# EAGLE design CameraBoard (EAGLE 9.6.1)

## Sheet 1 of 2: Power Management
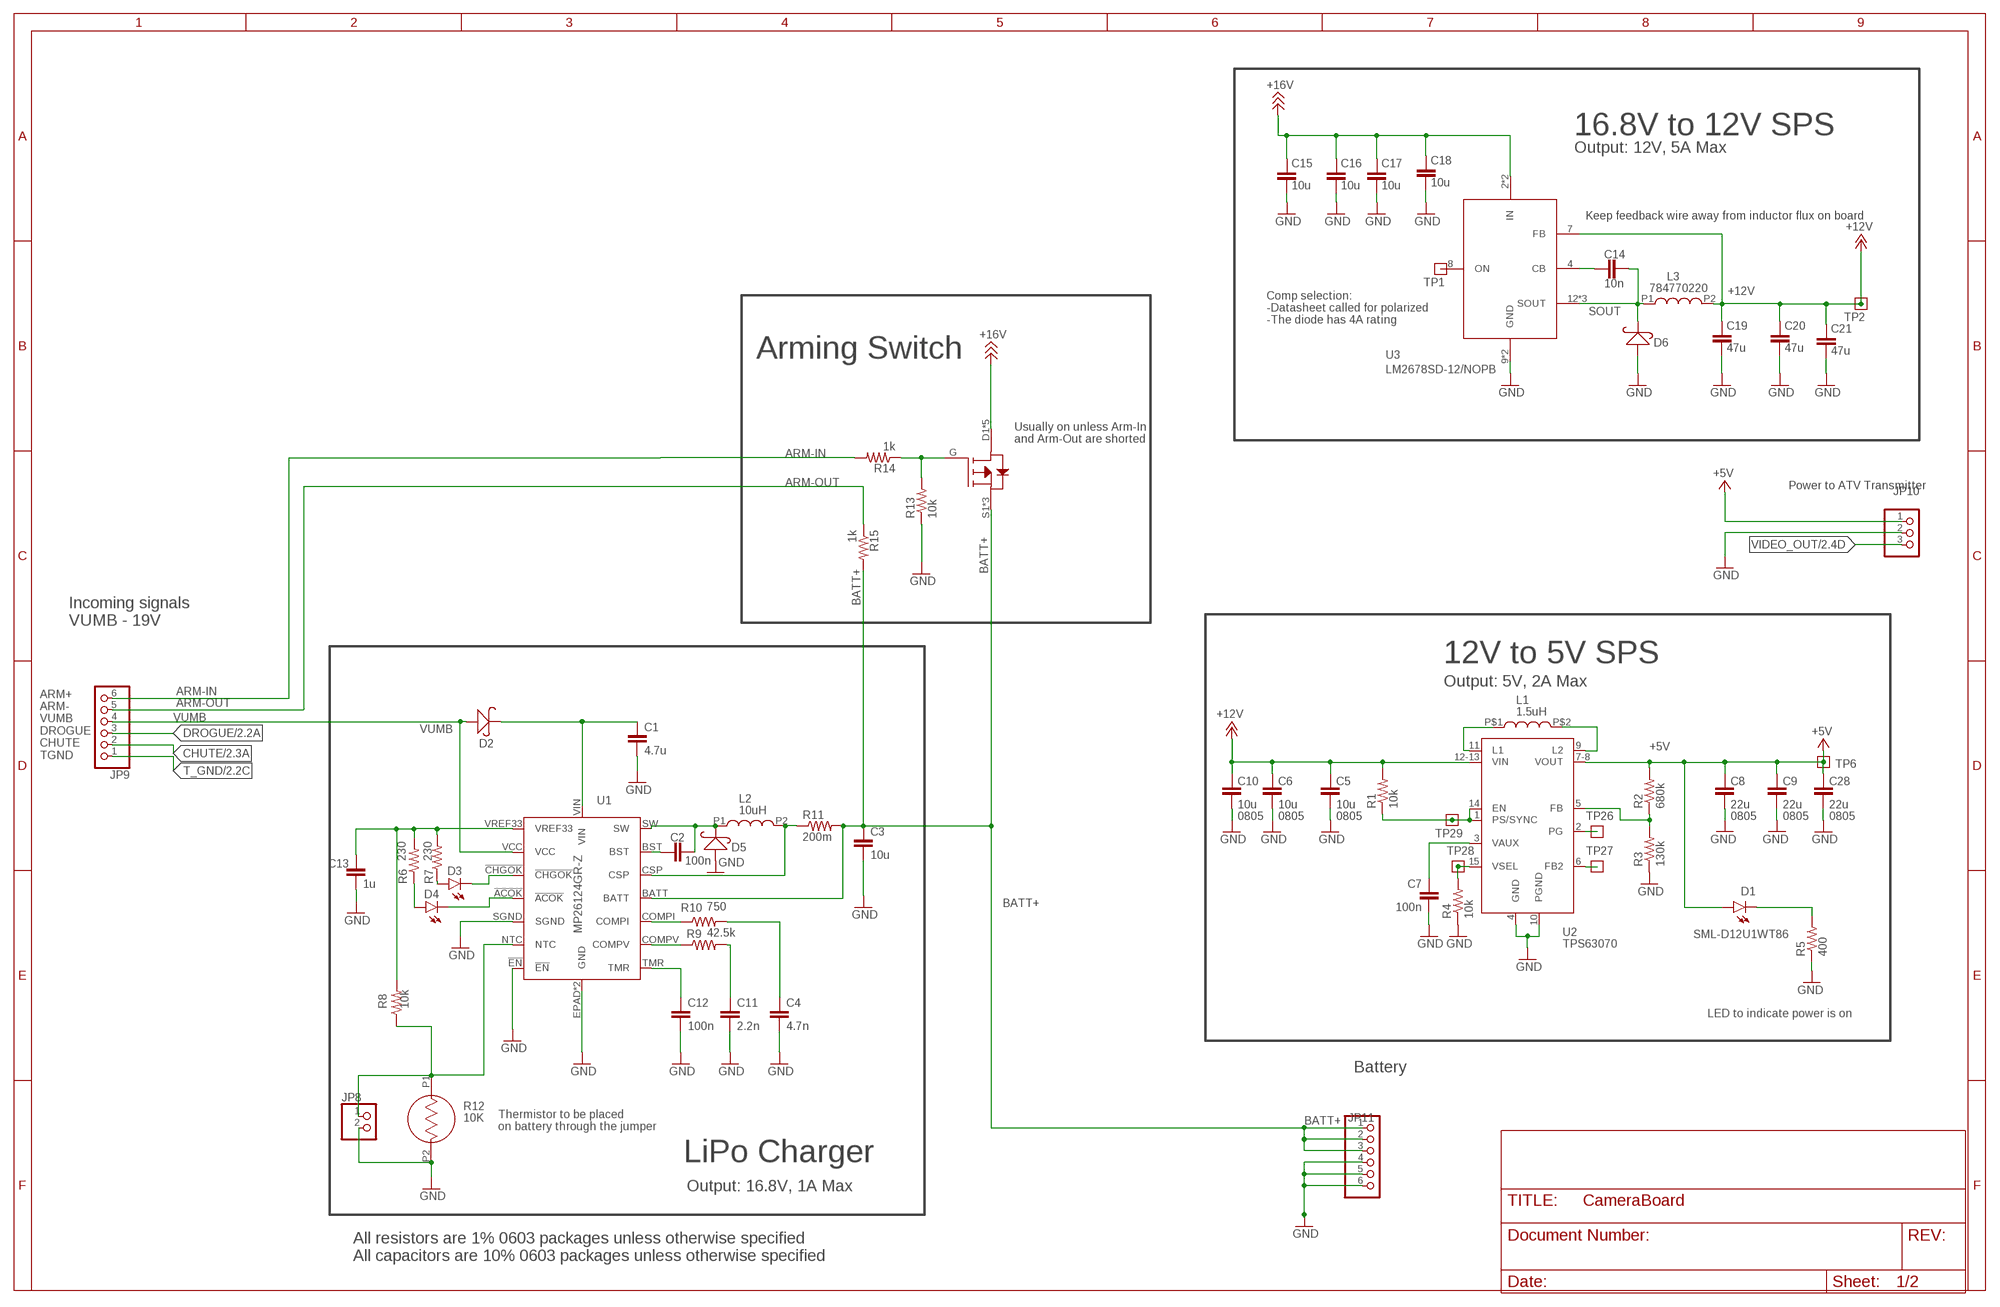
[diagram p0: schematic, sheet 1]

### Parts
C1  4.7u  C-EU0603-A-NOSILK  [.0603-A-NOSILK]
C2  100n  C-EU0603-A-NOSILK  [.0603-A-NOSILK]
C3  10u  C-EU0603-A-NOSILK  [.0603-A-NOSILK]
C4  4.7n  C-EU0603-A-NOSILK  [.0603-A-NOSILK]
C5  10u  C-EU0805-C-NOSILK  [.0805-C-NOSILK]
C6  10u  C-EU0805-C-NOSILK  [.0805-C-NOSILK]
C7  100n  C-EU0603-C-NOSILK  [.0603-C-NOSILK]
C8  22u  C-EU0805-C-NOSILK  [.0805-C-NOSILK]
C9  22u  C-EU0805-C-NOSILK  [.0805-C-NOSILK]
C10  10u  C-EU0805-C-NOSILK  [.0805-C-NOSILK]
C11  2.2n  C-EU0603-A-NOSILK  [.0603-A-NOSILK]
C12  100n  C-EU0603-A-NOSILK  [.0603-A-NOSILK]
C13  1u  C-EU0603-A-NOSILK  [.0603-A-NOSILK]
C14  10n  C-EU0603-A-NOSILK  [.0603-A-NOSILK]
C15  10u  C-EU0805-B-NOSILK  [.0805-B-NOSILK]
C16  10u  C-EU0805-B-NOSILK  [.0805-B-NOSILK]
C17  10u  C-EU0805-B-NOSILK  [.0805-B-NOSILK]
C18  10u  C-EU0805-B-NOSILK  [.0805-B-NOSILK]
C19  47u  C-EU1206-A  [1206-A]
C20  47u  C-EU1206-A  [1206-A]
C21  47u  C-EU1206-A  [1206-A]
C28  22u  C-EU0805-C-NOSILK  [.0805-C-NOSILK]
D1  SML-D12U1WT86  LEDCHIPLED_0603  [CHIPLED_0603]
D2  S2MA-13-F  [S2MA-13-F]
D3  SML-D12U1WT86  LEDCHIPLED_0603  [CHIPLED_0603]
D4  SML-D12U1WT86  LEDCHIPLED_0603  [CHIPLED_0603]
D5  S2MA-13-F  [S2MA-13-F]
D6  D_MBRS340T3G  [SMC]
JP8  PINHD-1X2  [1X02]
JP9  PINHD-1X6  [1X06]
JP10  PINHD-1X3  [1X03]
JP11  PINHD-1X6  [1X06]
L1  1.5uH  IHLP2020CZER1R5M11  [IHLP2020CZER1R5M11]
L2  10uH  1239AS-H-100M=P2  [1239AS-H-100M=P2]
L3  784770220  [784770220]
Q1  SI7465DP-T1-E3  [SI7465DP-T1-E3CT-ND]
R1  10k  R-US_0603-C-NOSILK  [.0603-C-NOSILK]
R2  680k  R-US_0603-C-NOSILK  [.0603-C-NOSILK]
R3  130k  R-US_0603-C-NOSILK  [.0603-C-NOSILK]
R4  10k  R-US_0603-C-NOSILK  [.0603-C-NOSILK]
R5  400  R-US_0603-C-NOSILK  [.0603-C-NOSILK]
R6  230  R-US_0603-A-NOSILK  [.0603-A-NOSILK]
R7  230  R-US_0603-A-NOSILK  [.0603-A-NOSILK]
R8  10k  R-US_0603-A-NOSILK  [.0603-A-NOSILK]
R9  42.5k  R-US_0603-A-NOSILK  [.0603-A-NOSILK]
R10  750  R-US_0603-A-NOSILK  [.0603-A-NOSILK]
R11  200m  R-US_1206-A  [1206-A]
R12  10K  NHQ103B375T10  [NHQ103B375T10]
R13  10k  R-US_0603-A-NOSILK  [.0603-A-NOSILK]
R14  1k  R-US_0603-A-NOSILK  [.0603-A-NOSILK]
R15  1k  R-US_0603-A-NOSILK  [.0603-A-NOSILK]
TP1  TEST-POINT  [2MM-TEST-POINT]
TP2  TEST-POINT  [2MM-TEST-POINT]
TP6  TEST-POINT  [2MM-TEST-POINT]
TP26  TEST-POINT  [2MM-TEST-POINT]
TP27  TEST-POINT  [2MM-TEST-POINT]
TP28  TEST-POINT  [2MM-TEST-POINT]
TP29  TEST-POINT  [2MM-TEST-POINT]
U1  MP26124GR-Z  [MP26124GR-Z]
U2  TPS63070  TPS63070X  [TPS63070X]
U3  LM2678SD-12/NOPB  [LM2678SD-12/NOPB]

### Nets
+5V: C8.1 C9.1 C28.1 D1.A JP10.1 R2.2 TP6.1 U2.7-8(VOUT) ; also sheet 2
+12V: C5.1 C6.1 C10.1 C19.1 C20.1 C21.1 L3.P2 R1.2 TP2.1 U2.12-13(VIN) U3.7(FB) ; also sheet 2
+16V: C15.1 C16.1 C17.1 C18.1 Q1.D1(D) Q1.D2(D) Q1.D3(D) Q1.D4(D) Q1.DPAD(D) U3.2(IN) U3.3(IN)
ARM-IN: JP9.6 R14.2
ARM-OUT: JP9.5 R15.1
BATT+: C3.1 JP11.1 JP11.2 JP11.3 Q1.S1(S) Q1.S2(S) Q1.S3(S) R11.2 R15.2 U1.BATT
CHUTE: JP9.2 ; also sheet 2
DROGUE: JP9.3 ; also sheet 2
GND: C1.2 C3.2 C4.2 C5.2 C6.2 C7.2 C8.2 C9.2 C10.2 C11.2 C12.2 C13.2 C15.2 C16.2 C17.2 C18.2 C19.2 C20.2 C21.2 C28.2 D5.ANODE(+) D6.2(+) JP8.2 JP10.2 JP11.4 JP11.5 JP11.6 R3.1 R4.1 R5.1 R12.P2 R13.1 U1.!EN U1.EPAD(GND) U1.GND U1.SGND U2.4(GND) U2.10(PGND) U3.9(GND) U3.DAP(GND) ; also sheet 2
N$1: D1.C R5.2
N$2: C1.1 D2.CATHODE(-) U1.VIN
N$3: Q1.G R13.2 R14.1
N$4: C13.1 R6.2 R7.2 R8.2 U1.VREF33
N$5: D4.A R6.1
N$6: D3.A R7.1
N$7: D3.C U1.!CHGOK
N$8: D4.C U1.!ACOK
N$9: C12.1 U1.TMR
N$10: JP8.1 R8.1 R12.P1 U1.NTC
N$11: R9.1 U1.COMPV
N$12: C11.1 R9.2
N$13: R10.1 U1.COMPI
N$14: C4.1 R10.2
N$15: C2.1 D5.CATHODE(-) L2.P1 U1.SW
N$16: C2.2 U1.BST
N$17: L2.P2 R11.1 U1.CSP
N$18: TP1.1 U3.8(ON)
N$20: C14.2 U3.4(CB)
SOUT: C14.1 D6.1(-) L3.P1 U3.12(SOUT) U3.13(SOUT) U3.14(SOUT)
T_GND: JP9.1 ; also sheet 2
TPS-EN: R1.1 TP29.1 U2.1(PS/SYNC) U2.14(EN)
TPS-FB: R2.1 R3.2 U2.5(FB)
TPS-FB2: TP27.1 U2.6(FB2)
TPS-L1: L1.P$1 U2.11(L1)
TPS-L2: L1.P$2 U2.9(L2)
TPS-PG: TP26.1 U2.2(PG)
TPS-VAUX: C7.1 U2.3(VAUX)
TPS-VSEL: R4.2 TP28.1 U2.15(VSEL)
VIDEO_OUT: JP10.3 ; also sheet 2
VUMB: D2.ANODE(+) JP9.4 U1.VCC

### Notes on the sheet
- 16.8V to 12V SPS
- Output: 12V, 5A Max
- Keep feedback wire away from inductor flux on board
- Comp selection:
  -Datasheet called for polarized
  -The diode has 4A rating
- Arming Switch
- Usually on unless Arm-In
  and Arm-Out are shorted
- Power to ATV Transmitter
- Incoming signals
  VUMB - 19V
- 12V to 5V SPS
- Output: 5V, 2A Max
- ARM+
  ARM-
  VUMB
  DROGUE
  CHUTE
  TGND
- 0805 | 0805 | 0805 | 0805 | 0805 | 0805
- LED to indicate power is on
- Battery
- Thermistor to be placed 
  on battery through the jumper
- LiPo Charger
- Output: 16.8V, 1A Max
- All resistors are 1% 0603 packages unless otherwise specified
  All capacitors are 10% 0603 packages unless otherwise specified

## Sheet 2 of 2: Camera Control
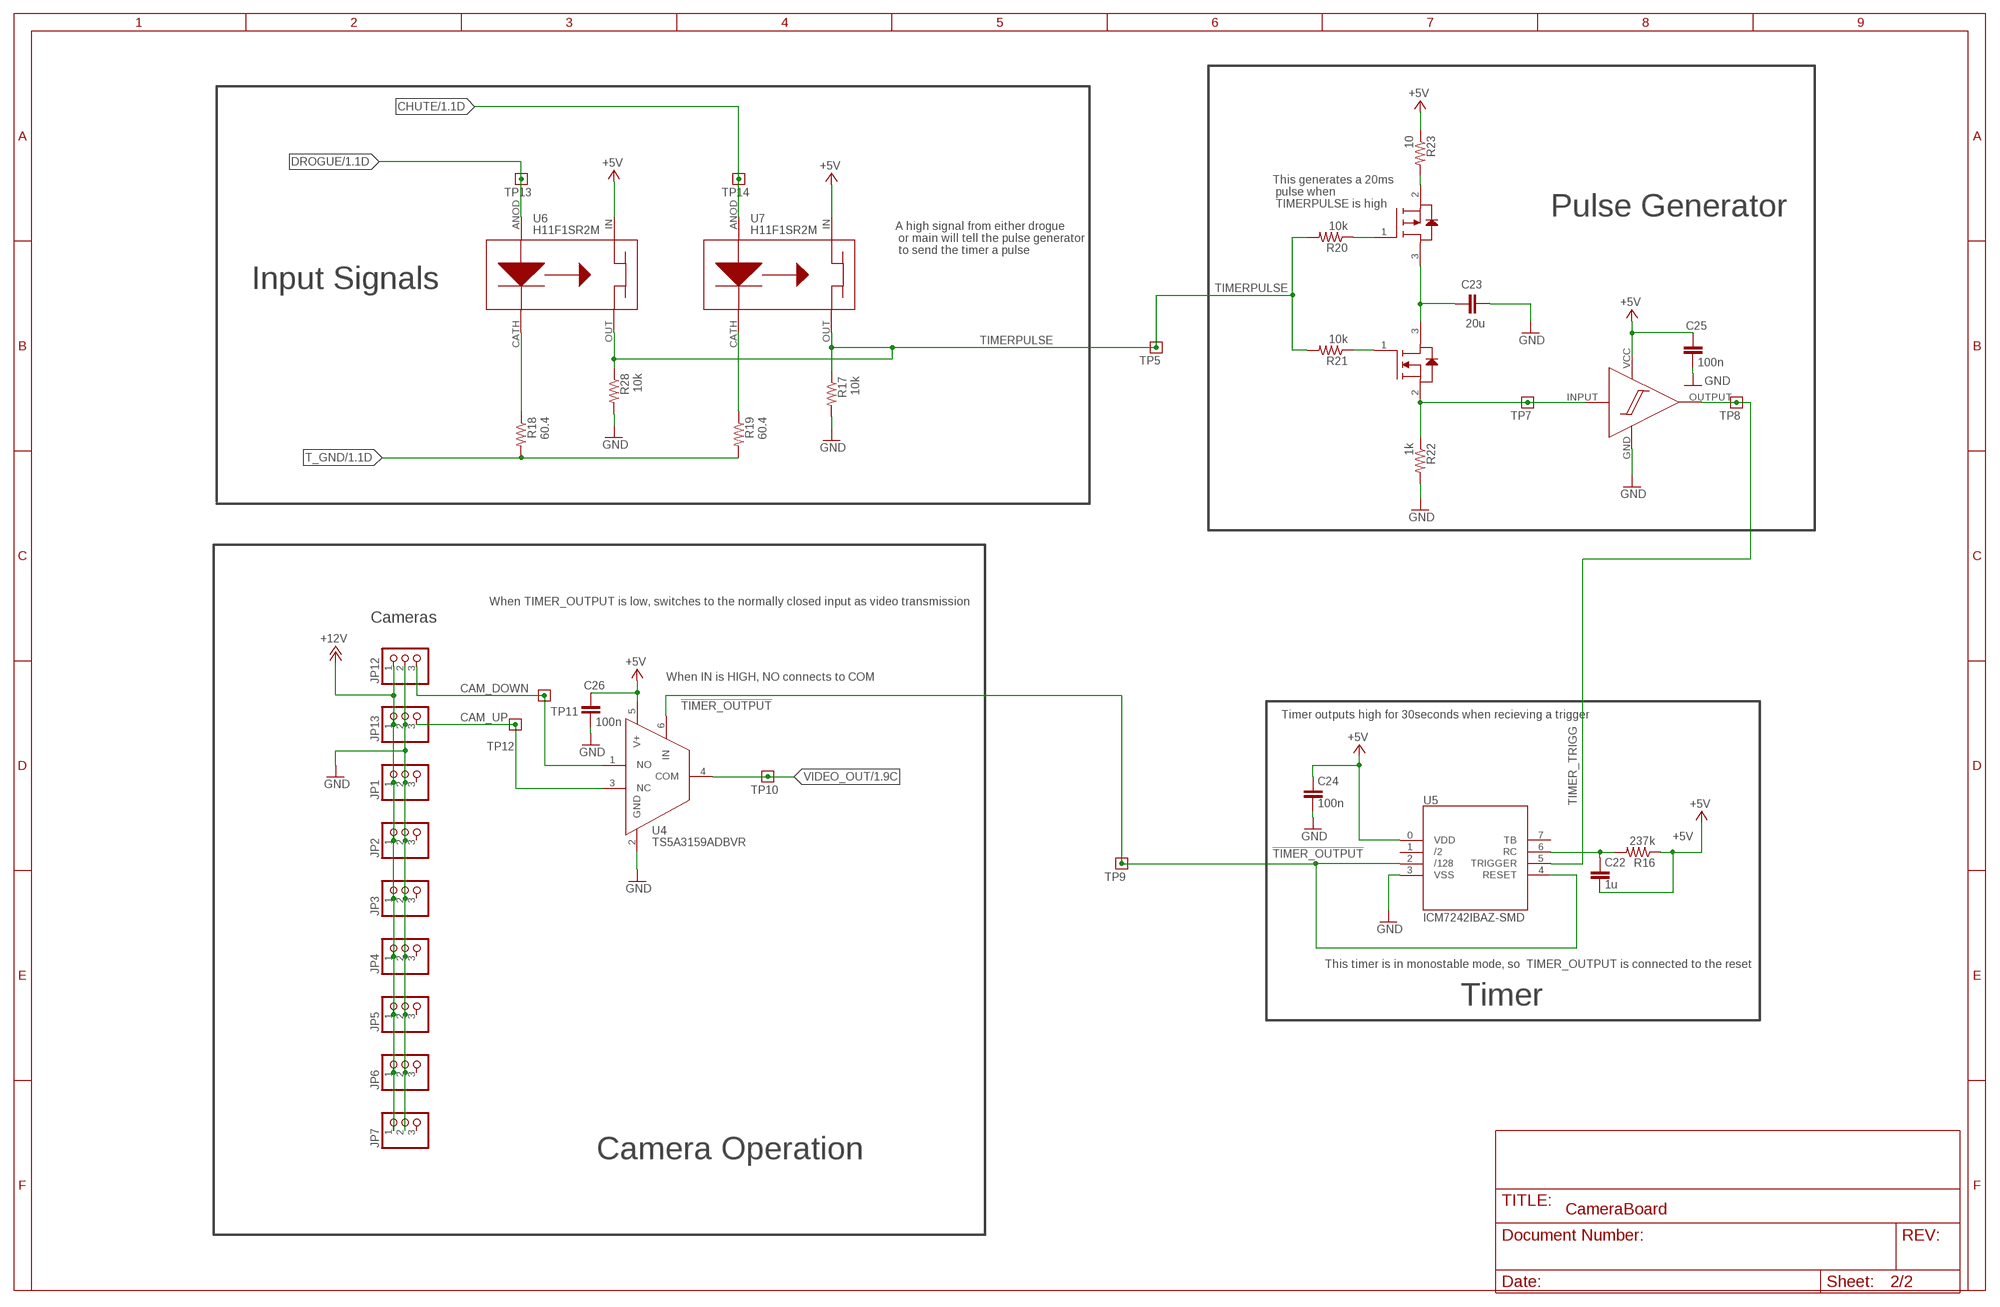
[diagram p1: schematic, sheet 2]

### Parts
C22  1u  C-EU0603-C-NOSILK  [.0603-C-NOSILK]
C23  20u  C-EU0603-C-NOSILK  [.0603-C-NOSILK]
C24  100n  C-EU0603-C-NOSILK  [.0603-C-NOSILK]
C25  100n  C-EU0603-C-NOSILK  [.0603-C-NOSILK]
C26  100n  C-EU0603-C-NOSILK  [.0603-C-NOSILK]
JP1  PINHD-1X3  [1X03]
JP2  PINHD-1X3  [1X03]
JP3  PINHD-1X3  [1X03]
JP4  PINHD-1X3  [1X03]
JP5  PINHD-1X3  [1X03]
JP6  PINHD-1X3  [1X03]
JP7  PINHD-1X3  [1X03]
JP12  PINHD-1X3  [1X03]
JP13  PINHD-1X3  [1X03]
Q2  BVSS123LT1G  [BVSS123LT1G]
Q3  BSS84  [BSS84]
R16  237k  R-US_0603-A-NOSILK  [.0603-A-NOSILK]
R17  10k  R-US_0603-C-NOSILK  [.0603-C-NOSILK]
R18  60.4  R-US_0603-C-NOSILK  [.0603-C-NOSILK]
R19  60.4  R-US_0603-C-NOSILK  [.0603-C-NOSILK]
R20  10k  R-US_0603-A-NOSILK  [.0603-A-NOSILK]
R21  10k  R-US_0603-A-NOSILK  [.0603-A-NOSILK]
R22  1k  R-US_0603-A-NOSILK  [.0603-A-NOSILK]
R23  10  R-US_0805-A-NOSILK  [.0805-A-NOSILK]
R28  10k  R-US_0603-C-NOSILK  [.0603-C-NOSILK]
TP5  TEST-POINT  [2MM-TEST-POINT]
TP7  TEST-POINT  [2MM-TEST-POINT]
TP8  TEST-POINT  [2MM-TEST-POINT]
TP9  TEST-POINT  [2MM-TEST-POINT]
TP10  TEST-POINT  [2MM-TEST-POINT]
TP11  TEST-POINT  [2MM-TEST-POINT]
TP12  TEST-POINT  [2MM-TEST-POINT]
TP13  TEST-POINT  [2MM-TEST-POINT]
TP14  TEST-POINT  [2MM-TEST-POINT]
U4  TS5A3159ADBVR  [TS5A3159ADBVR]
U5  ICM7242IBAZ-SMD  [ICM7242IBAZ-SMD]
U6  H11F1SR2M  [H11F1SR2M]
U7  H11F1SR2M  [H11F1SR2M]
U8  SN74LVC1G17DCKR  [SN74LVC1G17DCKR]

### Nets
!TIMER_OUTPUT: TP9.1 U4.6(IN) U5.2(/128) U5.4(RESET)
+5V: C22.2 C24.1 C25.2 C26.2 R16.1 R23.1 U4.5(V+) U5.0(VDD) U6.IN U7.IN U8.VCC ; also sheet 1
+12V: JP1.1 JP2.1 JP3.1 JP4.1 JP5.1 JP6.1 JP7.1 JP12.1 JP13.1 ; also sheet 1
CAM_DOWN: JP12.3 TP11.1 U4.1(NO)
CAM_UP: JP13.3 TP12.1 U4.3(NC)
CHUTE: TP14.1 U7.ANOD ; also sheet 1
DROGUE: TP13.1 U6.ANOD ; also sheet 1
GND: C23.2 C24.2 C25.1 C26.1 JP1.2 JP2.2 JP3.2 JP4.2 JP5.2 JP6.2 JP7.2 JP12.2 JP13.2 R17.2 R22.2 R28.2 U4.2(GND) U5.3(VSS) U8.GND ; also sheet 1
N$22: R18.1 U6.CATH(CAT)
N$23: R19.1 U7.CATH(CAT)
N$24: C22.1 R16.2 U5.6(RC)
N$25: C23.1 Q2.3(D) Q3.3(D)
N$26: Q3.2(S) R23.2
N$28: Q3.1(G) R20.1
N$29: Q2.1(G) R21.1
SCHMITTIN: Q2.2(S) R22.1 TP7.1 U8.INPUT(A)
T_GND: R18.2 R19.2 ; also sheet 1
TIMER_TRIGG: TP8.1 U5.5(TRIGGER) U8.OUTPUT(Y)
TIMERPULSE: R17.1 R20.2 R21.2 R28.1 TP5.1 U6.OUT U7.OUT
VIDEO_OUT: TP10.1 U4.4(COM) ; also sheet 1
Unconnected: JP1.3 JP2.3 JP3.3 JP4.3 JP5.3 JP6.3 JP7.3 U5.1(/2) U5.7(TB)

### Notes on the sheet
- This generates a 20ms
   pulse when
   TIMERPULSE is high
- Pulse Generator
- A high signal from either drogue
   or main will tell the pulse generator
   to send the timer a pulse
- Input Signals
- When TIMER_OUTPUT is low, switches to the normally closed input as video transmission
- Cameras
- When IN is HIGH, NO connects to COM
- Timer outputs high for 30seconds when recieving a trigger
- This timer is in monostable mode, so  TIMER_OUTPUT is connected to the reset
- Timer
- Camera Operation

## Library data of the parts
C1-C4 C6 C9-C26 C28 = oresat-rcl:C-EU: CAPACITOR, European symbol
C5 C7 C8 = oresat-rcl:C-EU: CAPACITOR, European symbol; DIS: Digi-Key; DPN: 1276-1001-1-ND; MFR: Samsung; MPN: CL05B104KO5NNNC
D1 D3 D4 = led:LED: LED OSRAM: - CHIPLED LG R971, LG N971, LY N971, LG Q971, LY Q971, LO R971, LY R971 LH N974, LH R974 LS Q976, LO Q976, LY Q976 LO Q996 - Hyper CHIPLED LW Q18S LB Q993, LB Q99A, LB R99A - SideLED LS A670, LO A670, LY A670, LG A670, LP A670 LB A673, LV A673, LT A673, LW A673 LH A674 LY A675 LS A676, LA A676, LO A676, LY A676, LW A676 LS A679, LY A679, LG A679 - Hyper Micro SIDELED® LS Y876, LA Y876, LO Y876, LY Y876 LT Y87S - SmartLED LW L88C, LW L88S LB L89C, LB L89S, LG L890 LS L89K, LO L89K, LY L89K LS L896, LA L896, LO L896, LY L896 - TOPLED LS T670, LO T670, LY T670, LG T670, LP T670 LSG T670, LSP T670, LSY T670, LOP T670, LYG T670 LG T671, LOG T671, LSG T671 LB T673, LV T673, LT T673, LW T673 LH T674 LS T676, LA T676, LO T676, LY T676, LB T676, LH T676, LSB T676, LW T676 LB T67C, LV T67C, LT T67C, LS T67K, LO T67K, LY T67K, LW E67C LS E67B, LA E67B, LO E67B, LY E67B, LB E67C, LV E67C, LT E67C LW T67C LS T679, LY T679, LG T679 LS T770, LO T770, LY T770, LG T770, LP T770 LB T773, LV T773, LT T773, LW T773 LH T774 LS E675, LA E675, LY E675, LS T675 LS T776, LA T776, LO T776, LY T776, LB T776 LHGB T686 LT T68C, LB T68C - Hyper Mini TOPLED® LB M676 - Mini TOPLED Santana® LG M470 LS M47K, LO M47K, LY M47K Source: http://www.osram.convergy.de LUXEON: - LUMILED® LXK2-PW12-R00, LXK2-PW12-S00, LXK2-PW14-U00, LXK2-PW14-V00 LXK2-PM12-R00, LXK2-PM12-S00, LXK2-PM14-U00 LXK2-PE12-Q00, LXK2-PE12-R00, LXK2-PE12-S00, LXK2-PE14-T00, LXK2-PE14-U00 LXK2-PB12-K00, LXK2-PB12-L00, LXK2-PB12-M00, LXK2-PB14-N00, LXK2-PB14-P00, LXK2-PB14-Q00 LXK2-PR12-L00, LXK2-PR12-M00, LXK2-PR14-Q00, LXK2-PR14-R00 LXK2-PD12-Q00, LXK2-PD12-R00, LXK2-PD12-S00 LXK2-PH12-R00, LXK2-PH12-S00 LXK2-PL12-P00, LXK2-PL12-Q00, LXK2-PL12-R00 Source: www.luxeon.com KINGBRIGHT: KA-3528ASYC Source: www.kingbright.com; DIS: Digikey; DPN: SML-D12M1WT86CT-ND; MAN: Rohm Semiconductor; MPN: SML-D12M1WT86
D2 D5 = D--S2MA-FDICT-ND--Schottky Diode 1.5A:S2MA-13-F
D6 = D--MBRS340T3G--Schottky Diode:D_MBRS340T3G; BUILT_BY: EMA_UL_Team; DIS: Digi-Key; DPN: MBRS340T3GOSTR-ND; MANUFACTURER_PART_NUMBER: MBRS340T3G; VENDOR: ON Semiconductor
JP1-JP7 JP10 JP12 JP13 = pinhead:PINHD-1X3: PIN HEADER
JP8 = pinhead:PINHD-1X2: PIN HEADER
JP9 JP11 = pinhead:PINHD-1X6: PIN HEADER
L1 = L--IHLP2020CZER1R5M11--1.5uHInductor:IHLP2020CZER1R5M11; DIS: Digi-Key; DPN: 541-1222-1-ND; MFR: Vishay Dale; MPN: IHLP2020BZER4R7M11
L2 = L--1239AS-H-100M=P2--10uH Inductor:1239AS-H-100M=P2; DIS: Digi-Key; DPN: 490-10563-2-ND; MAN: Murata Electronics; MPN: 1239AS-H-100M=P2
L3 = L--784770220--22uH 4A Inductor:784770220; DIS: Digi-Key; DPN: 732-6785-1-ND; MAN: Würth Elektronik; MPN: 784770220
Q1 = Q--Si7465DP--Vishay Power MOSFET with multple S+D leads:SI7465DP-T1-E3; DIS: DigiKey; DPN: SI7465DP-T1-E3CT-ND; MFR: Vishay Siliconix; MPN: SI7465DP-T1-E3
Q2 = Q--BVSS123LT1G--NCH MOSFET:BVSS123LT1G; DIS: Digi-Key; DPN: BVSS123LT1GOSCT-ND; MAN: On Semiconductor; MPN: BVSS123LT1G
Q3 = Q--BSS84CT-ND--PCH MOSFET:BSS84; DIS: Digi-Key; DPN: BSS84CT-ND; MAN: On Semiconductor; MPN: BSS84
R1-R5 = oresat-rcl:R-US_: RESISTOR, American symbol; DIS: Digi-Key; DPN: 1276-4275-1-ND; MFR: Samsung; MPN: RC1005F6653CS
R6-R11 R13-R23 R28 = oresat-rcl:R-US_: RESISTOR, American symbol
R12 = R--NHQ103B375T10--Thermistor 10K:NHQ103B375T10; DIS: Digi-Key; DPN: 235-1109-1-ND; MAN: Amphenol Advanced Sensors; MPN: NHQ103B375T10
TP1 TP2 TP5-TP14 TP26-TP29 = Tova:TEST-POINT
U1 = U--MP26124GR-Z--4S LiPo Charger :MP26124GR-Z; DIS: Digi-Key; DPN: 1589-1993-1-ND; MAN: Monolithic Power Systems Inc.; MPN: MP26124GR-Z
U2 = ic-pwr-tps63070x:TPS63070X: TPS63070 2-V to 16-V Buck-Boost Converter With 3.6-A Switch Current; DIS: Digi-Key; DPN: 296-44874-2-ND; MAN: Texas Instruments; MPN: TPS63070RNMR
U3 = U--LM2678SX-12-NOPB--TI 12V SPS:LM2678SD-12/NOPB; DIS: Digi-Key; DPN: 296-40166-1-ND; MAN: Texas Instruments; MPN: LM2678SD-12/NOPB
U4 = U--TS5A3159ADBVR--Analog Switch 5V and 3V3:TS5A3159ADBVR
U5 = U--ICM7242--Counter-Timer Circuit:ICM7242IBAZ-SMD; DIS: Digi-Key; DPN: 2156-ICM7242IBAZ-IL-ND; MAN: Rochester Electronics LLC; MPN: ICM7242IBAZ
U6 U7 = Q--H11F1SR2M--OptoIsolator:H11F1SR2M; DIS: Digi-Key; DPN: H11F1SR2MCT-ND; MAN: ON Semiconductor; MPN: H11F1SR2M
U8 = U--SN74LVC1G17--Schmitt Trigger Buffer:SN74LVC1G17DCKR; DIS: Digi-Key; DPN: 296-11934-1-ND; MAN: Texas Instruments; MPN: SN74LVC1G17DCKR

## Board
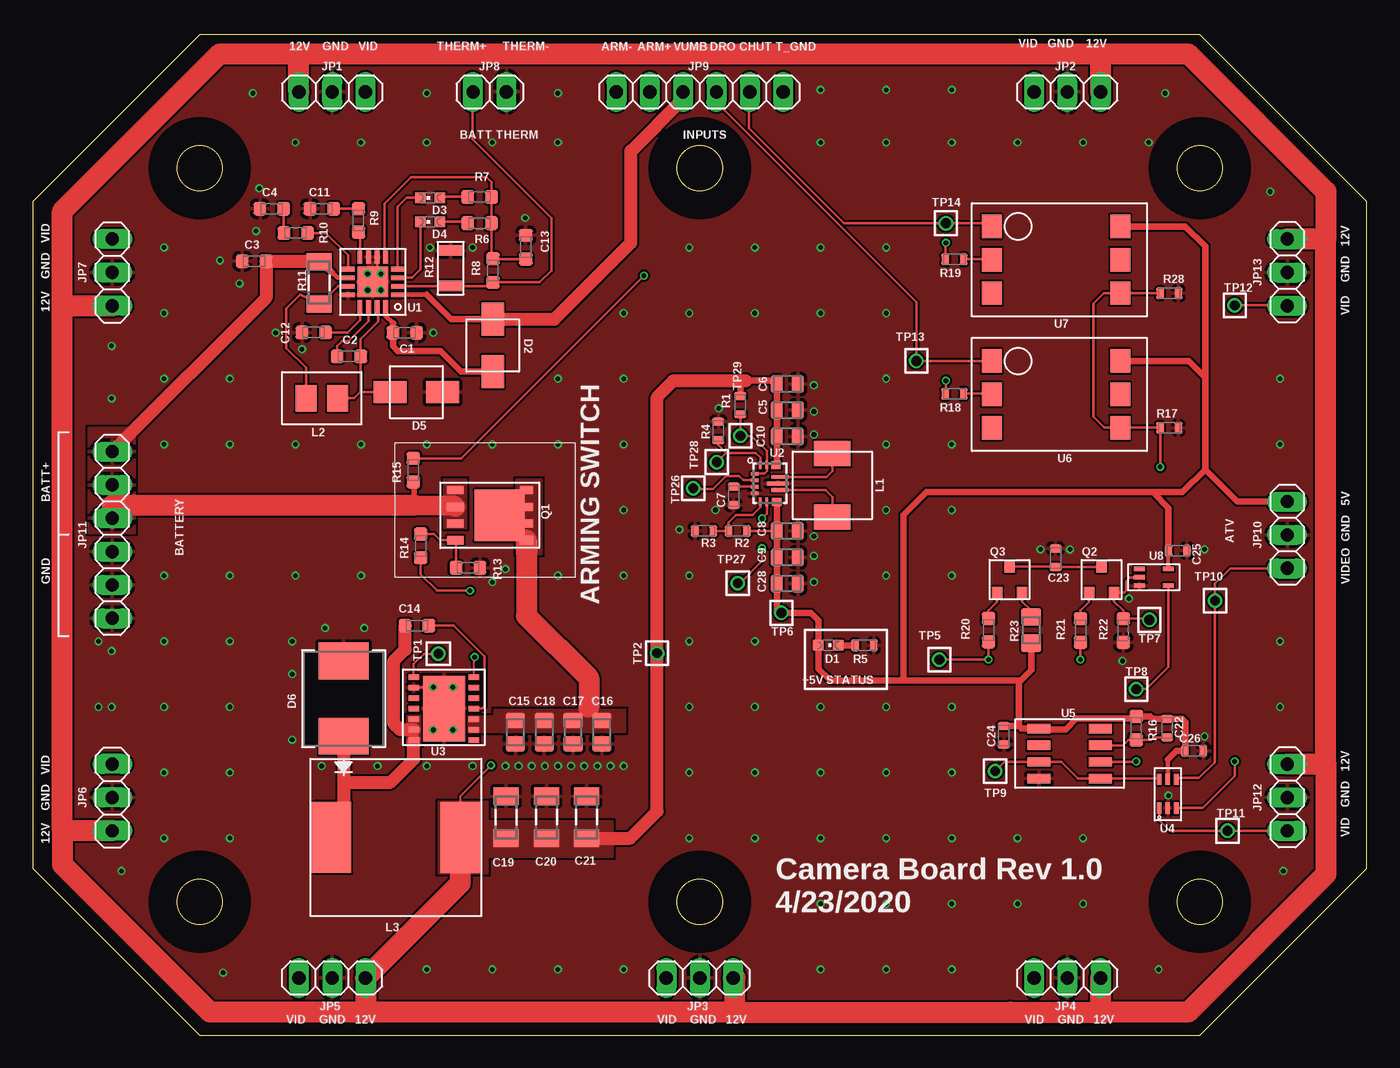
[diagram p2: board, top side]
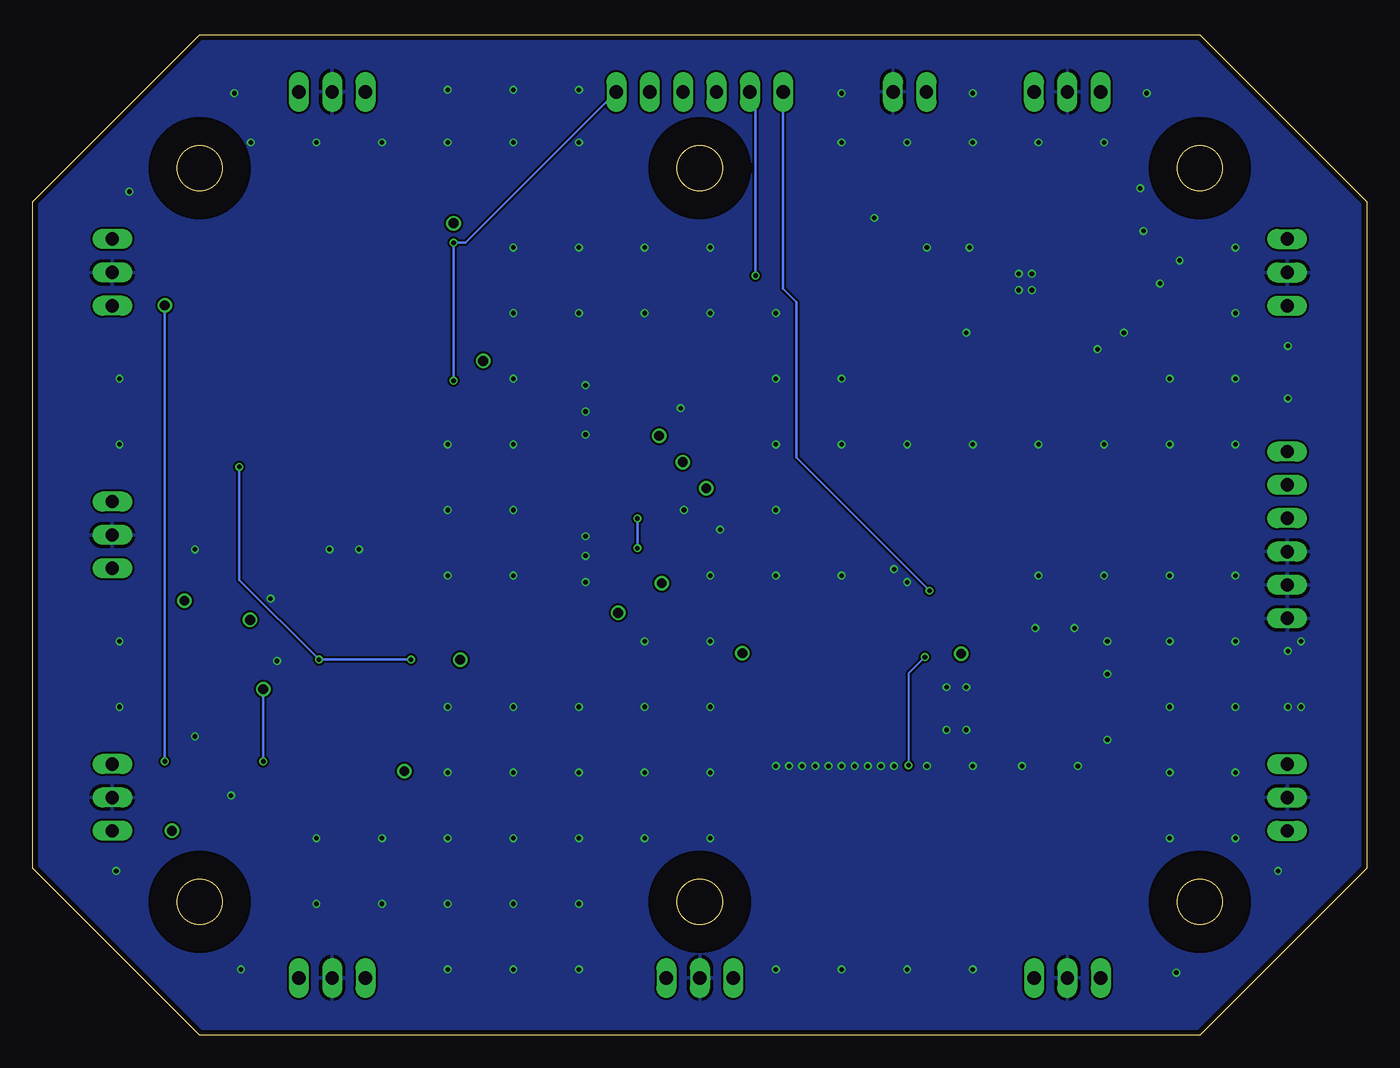
[diagram p3: board, bottom side, seen from below]

Size 101.6 x 76.2 mm. Coordinates in mm from the lower left corner, seen from the top.
Outline: 0,12.7 12.7,0 88.9,0 101.6,12.7 101.6,63.5 88.9,76.2 12.7,76.2 0,63.5 0,12.7
Outline: circle at 12.7,66.04 radius 1.73
Outline: circle at 50.8,66.04 radius 1.73
Outline: circle at 88.9,10.16 radius 1.73
Outline: circle at 12.7,10.16 radius 1.73
Outline: circle at 50.8,10.16 radius 1.73
Outline: circle at 88.9,66.04 radius 1.73
Copper layers (1*16): Top 0.035559375mm / dielectric 1.6mm / Bottom 0.035559375mm
Design rules "oshpark-4layer *": minimum track width 6mil, minimum drill 10mil, track to track 6mil, track to pad 6mil, pad to pad 6mil, via to via 6mil, smd to smd 6mil, copper to edge 15mil, drill to drill 6mil, minimum pad ring 5mil, minimum via ring 5mil, stop-mask expansion 2.5mil, vias tented up to drill 0.35mm, thermal gap 10mil
tKeepout: area 8.8,6.3 to 16.6,14; area 8.8,62.2 to 16.6,69.9; area 46.9,62.2 to 54.7,69.9; area 85,62.2 to 92.8,69.9; area 85,6.3 to 92.8,14; area 46.9,6.3 to 54.7,14
bKeepout: area 8.8,62.2 to 16.6,69.9; area 46.9,62.2 to 54.7,69.9; area 85,62.2 to 92.8,69.9; area 46.9,6.3 to 54.7,14; area 85,6.3 to 92.8,14; area 8.8,6.3 to 16.6,14
tRestrict: area 8.8,6.3 to 16.6,14; area 8.8,62.2 to 16.6,69.9; area 46.9,62.2 to 54.7,69.9; area 85,62.2 to 92.8,69.9; area 85,6.3 to 92.8,14; area 46.9,6.3 to 54.7,14
bRestrict: area 8.8,62.2 to 16.6,69.9; area 46.9,62.2 to 54.7,69.9; area 85,62.2 to 92.8,69.9; area 46.9,6.3 to 54.7,14; area 85,6.3 to 92.8,14; area 8.8,6.3 to 16.6,14

### Footprints (pad centres in the part's own frame; a part is rotated, then mirrored left to right if it is on the bottom)
.0603-A-NOSILK = smd 1 x 1.05: 1 -0.9,0; 2 0.9,0
.0805-C-NOSILK = smd 0.95 x 1.35: 1 -0.8,0; 2 0.8,0
.0603-C-NOSILK = smd 0.6 x 0.9: 1 -0.7,0; 2 0.7,0
.0805-B-NOSILK = smd 1.15 x 1.45: 1 -0.9,0; 2 0.9,0
1206-A = smd 1.35 x 1.9: 1 -1.6,0; 2 1.6,0
CHIPLED_0603 = smd 0.8 x 0.8: A 0,-0.75; C 0,0.75
S2MA-13-F = smd 2.5 x 1.7: ANODE -2,0; CATHODE 2,0
SMC = smd 2.794 x 3.81: 1 -2.87,0; 2 2.87,0
1X03 = drill 1.016 long: 1 -2.54,0; 2 0,0; 3 2.54,0
1X02 = drill 1.016 long: 1 -1.27,0; 2 1.27,0
1X06 = drill 1.016 long: 1 -6.35,0; 2 -3.81,0; 3 -1.27,0; 4 1.27,0; 5 3.81,0; 6 6.35,0
IHLP2020CZER1R5M11 = smd 1.905 x 2.79: P$1 -2.42,0; P$2 2.42,0
1239AS-H-100M=P2 = smd 1.6 x 2: P1 -1.2,0; P2 1.2,0
784770220 = smd 5.4 x 3: P1 0,4.9; P2 0,-4.9
SI7465DP-T1-E3CT-ND = smd 1.02 x 0.61: D1 2.055,-1.905; D2 2.055,-0.635; D3 2.055,0.635; D4 2.055,1.905 | smd 3.81 x 3.91: DPAD 0,0 | smd 1.27 x 0.61: G -3.36,-1.905; S1 -3.36,1.905; S2 -3.36,0.635; S3 -3.36,-0.635
BVSS123LT1G = smd 0.8 x 0.9: 1 -0.95,0; 2 0.95,0; 3 0,2
BSS84 = smd 0.8 x 0.9: 1 -0.95,0; 2 0.95,0; 3 0,2
NHQ103B375T10 = smd 0.8 x 1.9: P1 -1.35,0; P2 1.35,0
.0805-A-NOSILK = smd 1.35 x 1.55: 1 -1,0; 2 1,0
2MM-TEST-POINT = drill 0.737: 1 0,0
MP26124GR-Z = smd 1 x 0.35: !ACOK -1.9,-0.325; !CHGOK -1.9,-0.975; BATT 1.9,-0.325; COMPI 1.9,-0.975; CSP 1.9,0.325; GND 1.9,0.975; NTC -1.9,0.325; VCC -1.9,0.975 | smd 0.35 x 1: !EN -0.325,-1.9; BST 0.325,1.9; COMPV 0.975,-1.9; SGND 0.325,-1.9; SW -0.325,1.9; TMR 0.975,1.9; VIN -0.975,1.9; VREF33 -0.975,-1.9 | smd 2.3 x 2.3: EPAD 0,0
TPS63070X = smd 0.6 x 0.25: 1 -1.15,0.75; 2 -1.15,0.25; 3 -1.15,-0.25; 4 -1.15,-0.75 | smd 0.25 x 0.6: 5 -0.725,-1.4; 6 -0.225,-1.4; 14 -0.225,1.4; 15 -0.725,1.4 | smd 0.75 x 0.6: 7-8 0.525,-1.4; 12-13 0.475,1.4 | smd 1.35 x 0.25: 9 0.775,-0.5; 11 0.775,0.5 | smd 1.7 x 0.25: 10 0.6,0
LM2678SD-12/NOPB = smd 0.4 x 0.8: 1 0,0; 2 0.8,0; 3 1.6,0; 4 2.4,0; 5 3.2,0; 6 4,0; 7 4.8,0; 8 4.8,4.6; 9 4,4.6; 10 3.2,4.6; 11 2.4,4.6; 12 1.6,4.6; 13 0.8,4.6; 14 0,4.6 | smd 5 x 3.2: DAP 2.4,2.3
TS5A3159ADBVR = smd 0.35 x 0.85: 1 0,0; 2 0.65,0; 3 1.3,0; 4 1.3,2.2; 5 0.65,2.2; 6 0,2.2
ICM7242IBAZ-SMD = smd 0.72 x 1.78: 0 0,0; 1 1.27,0; 2 2.54,0; 3 3.81,0; 4 3.81,4.68; 5 2.54,4.68; 6 1.27,4.68; 7 0,4.68
H11F1SR2M = smd 1.52 x 1.78: ANOD 0,0; CATH 0,-2.54; IN 9.78,0; OUT 9.78,-5.08; P0 9.78,-2.54; P2 0,-5.08
SN74LVC1G17DCKR = smd 0.35 x 0.85: GND 1.3,0; INPUT 0.65,0; NC 0,0; OUTPUT 1.3,2.2; VCC 0,2.2

### Placement (x,y rotation side)
C1  28.33,53.5 0 top
C2  24.08,51.7 180 top
C3  16.86,58.95 180 top
C4  18.2,62.95 180 top
C5  57.47,47.6 0 top
C6  57.47,49.6 0 top
C7  53.38,41.08 270 top
C8  57.47,38.4 0 top
C9  57.47,36.4 0 top
C10  57.47,45.6 0 top
C11  22.01,62.95 180 top
C12  21.4,53.52 180 top
C13  37.55,60.02 90 top
C14  29.26,31.2 0 top
C15  36.76,23.07 270 top
C16  43.34,23.07 270 top
C17  41.15,23.07 270 top
C18  38.95,23.07 270 top
C19  36.05,16.6 90 top
C20  39.12,16.6 90 top
C21  42.18,16.6 90 top
C22  86.39,23.38 90 top
C23  77.9,36.35 90 top
C24  73.96,22.84 270 top
C25  87.2,36.9 180 top
C26  88.45,21.65 180 top
C28  57.47,34.4 0 top
D1  60.59,29.69 270 top
D2  35.03,52.54 270 top
D3  30.26,63.78 90 top
D4  30.26,61.95 90 top
D5  29.22,48.98 180 top
D6  23.68,25.63 90 top
JP1  22.8,71.85 0 top
JP2  78.8,71.85 180 top
JP3  50.8,4.35 180 top
JP4  78.8,4.35 180 top
JP5  22.8,4.35 180 top
JP6  6.05,18.1 90 top
JP7  6.05,58.1 90 top
JP8  34.8,71.85 0 top
JP9  50.8,71.85 180 top
JP10  95.55,38.1 270 top
JP11  6.05,38.1 270 top
JP12  95.55,18.1 270 top
JP13  95.55,58.1 270 top
L1  60.9,41.88 270 top
L2  22.01,48.51 180 top
L3  27.65,15.05 90 top
Q1  35.55,39.6 0 top
Q2  81.4,33.7 0 top
Q3  74.4,33.7 0 top
R1  53.89,47.99 90 top
R2  53.69,38.4 0 top
R3  51.13,38.4 0 top
R4  52.21,46.02 270 top
R5  63.35,29.69 180 top
R6  34.03,61.85 0 top
R7  34.03,63.85 0 top
R8  35.05,58.24 90 top
R9  24.8,62.05 90 top
R10  20.03,61.1 180 top
R11  21.8,57.31 90 top
R12  31.82,58.42 90 top
R13  33.15,35.6 180 top
R14  29.55,37.26 270 top
R15  28.98,43.04 270 top
R16  84.05,23.38 270 top
R17  86.57,46.26 0 top
R18  70.2,48.85 180 top
R19  70.2,59.1 180 top
R20  72.8,30.84 270 top
R21  79.8,30.82 270 top
R22  83.05,30.82 270 top
R23  76.05,30.85 90 top
R28  86.57,56.51 0 top
TP1  30.9,29.05 90 top
TP2  47.55,29.1 0 top
TP5  69.05,28.6 0 top
TP6  57.02,32.16 0 top
TP7  85.05,31.62 0 top
TP8  84.05,26.35 0 top
TP9  73.3,20.1 0 top
TP10  90.05,33.1 0 top
TP11  91,15.56 0 top
TP12  91.55,55.6 0 top
TP13  67.3,51.35 0 top
TP14  69.55,61.85 0 top
TP26  50.3,41.65 0 top
TP27  53.7,34.41 0 top
TP28  52.1,43.65 0 top
TP29  53.9,45.65 0 top
U1  25.9,57.37 180 top
U2  56.14,42.02 0 top
U3  33.61,22.47 90 top
U4  85.8,17.29 0 top
U5  76.63,23.35 270 top
U6  73.05,51.35 0 top
U7  73.05,61.6 0 top
U8  84.28,35.52 270 top

### Tracks (layer width: path | path; a pad name or v marks a point on that pad's centre or on a via)
!TIMER_OUTPUT
  Top 0.2: U4.6 85.75,19.54 U5.4 79.61,19.54 78.34,20.81 U5.2 74.01,20.81 TP9.1
+5V
  Top 0.2: R2.2 C8.1
  Top 0.3: U8.VCC 86.48,36.88 C25.2
  Top 0.35: 86.45,21 U4.5
  Top 0.5: U2.7-8 C8.1 C9.1 C28.1 56.67,32.51 TP6.1 59.27,32.16 59.84,31.59 D1.A 59.84,27.91 60.75,27 66.3,27 | C24.1 75.11,23.54 | 75.11,23.54 75.3,23.35 U5.0 76.7,23.28 78.67,23.28 79.5,24.11 83.88,24.11 R16.1 85.12,24.28 85.32,24.08 C22.2 87.57,24.08 87.8,23.85 87.8,21.7 C26.2 87.1,21.65 86.45,21 | 66.3,27 66.3,39.6 68.05,41.35 85.3,41.35 | 85.3,41.35 87.55,41.35 89.3,43.1 | 89.3,50.1 89.3,43.1 | 89.3,50.1 89.3,60.1 87.8,61.6 U7.IN | U6.IN 88.05,51.35 89.3,50.1 | 89.3,43.1 91.76,40.64 JP10.1 | C25.2 86.5,40.15 85.3,41.35 | R23.1 76.05,27.8 75.25,27 | 66.3,27 75.25,27 | 75.25,27 75.11,26.86 75.11,23.54
+12V  (via drill 0.35)
  Top 0.152: U3.7 33.61,28.76 v33.65,28.8 | L3.P2 32.55,18.2 v34.9,20.55
  Top 0.5: R1.2 53.89,49.44 54.3,49.85 56.42,49.85 C6.1 C5.1 C10.1 56.67,43.48 U2.12-13
  Top 1: 54.3,49.85 48.8,49.85 47.55,48.6 TP2.1 47.55,17.05 45.5,15 C21.1
  Top 1.6: L3.P2 32.55,11.56 JP5.1 25.34,1.75 | 53.5,1.75 53.5,4.35 JP3.1 | 53.5,1.75 74.48,1.75 81.34,1.75 | 81.34,1.75 JP4.1 | 53.5,1.75 25.34,1.75 | JP6.1 2.25,15.56 | 2.25,55.56 JP7.1 | 2.25,15.56 2.25,55.56 | JP1.1 20.26,74.75 | JP2.1 81.34,74.75 | 20.26,74.75 81.34,74.75 | JP12.1 98.5,20.64 | 98.5,60.64 JP13.1 | 98.5,20.64 98.5,60.64 | 81.34,74.75 88,74.75 98.5,64.25 98.5,60.64 | 98.5,20.64 98.5,12.25 88,1.75 81.34,1.75 | 2.25,15.56 2.25,13 13.5,1.75 25.34,1.75 | 2.25,55.56 2.25,62.75 14.25,74.75 20.26,74.75
  Bottom 0.152: v33.65,28.8 34.9,27.55 v34.9,20.55
  pour Top (no thermals): 44.15,13.55 34.65,13.55 34.65,12.3 30.9,12.3 30.9,17.8 34.65,17.8 34.65,16.3 44.15,16.3
+16V
  Top 0.4: 42.35,24.96 C16.1
  Top 1.6: Q1.D1 37.6,31.95 42.35,27.2 42.35,24.96
  pour Top (no thermals): 38.8,36.6 36.8,36.6 36.8,42.35 38.8,42.35
  pour Top (no thermals): 45.15,23.05 45.15,24.8 35.15,24.8 35.15,23.05
  pour Top (no thermals): 35.15,23.05 33.15,23.05 33.15,24.3 35.15,24.3
ARM-IN  (via drill 0.35)
  Top 0.2: R14.2 29.55,35.1 30.8,33.85 v33.3,33.85
  Bottom 0.2: v33.3,33.85 43.45,44 43.45,55.85 44.45,56.85 JP9.6
ARM-OUT  (via drill 0.35)
  Top 0.2: R15.1 32.64,43.94 v46.55,57.85
  Bottom 0.2: v46.55,57.85 46.55,71.41 JP9.5
BATT+
  Top 0.35: U1.BATT 23.2,57.7 22.8,58.1
  Top 0.4: R15.2 29.05,42.06 29.05,40.35
  Top 0.5: 22.8,58.1 22.69,58.21 R11.2
  Top 1: R11.2 21.75,58.95 C3.1 17.76,56.16 JP11.1
  Top 1.5: 29.05,40.35 32.08,40.35 Q1.S2
  Top 1.6: 29.05,40.35 6.05,40.35 JP11.3
  pour Top (no thermals): 33.05,38.6 31.3,38.6 31.3,42.35 33.05,42.35
  pour Top: 4.25,46.25 7.75,46.25 7.75,38.25 4.25,38.25
CAM_DOWN
  Top 0.2: U4.1 85.8,16.35 86.59,15.56 TP11.1 JP12.3
CAM_UP  (via drill 0.35)
  Top 0.2: U4.3 89.1,17.29 91.55,19.74 v91.55,20.85 | TP12.1 95.51,55.6 JP13.3
  Bottom 0.2: TP12.1 v91.55,20.85
CHUTE
  Top 0.2: U7.ANOD 72.8,61.85 TP14.1 61.8,61.85 54.55,69.1 54.55,71.79 JP9.2
DROGUE
  Top 0.2: JP9.3 52.07,71.08 67.3,55.85 TP13.1 U6.ANOD
GND  (via drill 0.35)
  Top 0.2: U1.!EN 26.23,57.7 U1.EPAD | U3.9 29.71,26.47 U3.DAP
  other vias: 26.5,58 26.5,56.75 25.5,56.75 25.5,58 50,25 55,25 60,25 65,25 70,25 70,20 65,20 60,20 55,20 50,20 50,15 55,15 60,15 65,15 70,15 70,10 65,10 60,10 60,5 65,5 70,5 75,10 80,10 80,15 75,15 95,30 95,25 95,45 95,50 60,68 65,68 70,68 40,68 30,68 35,68 25,68 20,68 50,55 55,55 60,55 65,55 65,60 60,60 55,60 50,60 65,50 65,45 70,45 70,40 65,40 65,35 70,35 55,30 50,30 50,35 45,35 40,35 45,5 40,5 35,5 30,5 5,25 5,30 10,60 10,55 10,50 10,45 15,45 15,50 20,45 25,45 25,35 20,35 15,35 10,35 10,30 15,30 15,25 10,25 10,20 15,20 15,15 10,15 75,68 80,68 85,68 45,55 45,50 45,45 45,40 40,50 40,45 35,45 30,45 59.5,38 59.5,36.5 59.5,34.5 49.25,38.5 52,40 52.25,47.75 59.5,45.75 59.5,47.5 59.5,49.5 79,37 76.75,37 83,28.5 83.5,33.25 89.25,37 86.5,18.25 89.25,22.75 36,20.5 37,20.5 38,20.5 39,20.5 40,20.5 41,20.5 42,20.5 43,20.5 44,20.5 45,20.5 35,34.5 36,35.5 20.5,52.25 30.5,53.5 30.25,60 37.5,62.25 17.25,64.5 17,61.25 15.75,57.25 14.25,59 18.5,53.5 33.5,60 60,72 65,72 70,72 40,71.75 30,71.75 16.75,71.75 6,52.5 6,48.5 6,29.25 6,25 6.75,12.5 14.5,4.75 85.75,5 95.25,12.5 94.25,64.25 86.25,71.75 30.5,26.5 32,26.5 32,23.25 30.5,23.25 22.25,31 25.25,31 33.5,20.5 30,20.5 26.25,20.5 22,20.5 19.75,22.5 19.75,27.5 19.75,30
  pour Top (rank 5): 0,0 0.05,76.2 101.6,76.2 101.6,0
  pour Bottom (rank 6): 0.05,76.2 101.6,76.2 101.6,0 0,0
N$1
  Top 0.5: D1.C R5.2
N$2
  Top 0.35: U1.VIN 26.88,54.77 27.43,54.22
  Top 0.5: 27.43,54.22 C1.1 27.43,52.47 27.8,52.1 31.05,52.1 32.61,50.54 D2.CATHODE
N$3
  Top 0.2: R14.1 30.55,38.16 31.02,37.7 Q1.G 32.25,37.63 R13.2
N$4
  Top 0.152: 35.07,59.12 R8.2 34.93,59.26 | 26.8,59.34 U1.VREF33
  Top 0.2: 35.07,59.12 C13.1 | 34.93,59.26 R6.2 R7.2 34.93,64.97 34.55,65.35 28.8,65.35 26.8,63.35 26.8,59.34
N$5
  Top 0.152: 33.03,61.95 R6.1
  Top 0.2: D4.A 33.03,61.95
N$6
  Top 0.152: D3.A 31.08,63.85
  Top 0.2: 31.08,63.85 R7.1
N$7
  Top 0.2: D3.C 28.48,63.78 27.8,63.1 U1.!CHGOK
N$8
  Top 0.152: 29.55,61.91 D4.C
  Top 0.2: U1.!ACOK 28.89,57.7 29.55,58.35 29.55,61.91
N$9
  Top 0.2: C12.1 23.98,53.52 24.93,54.48 U1.TMR
N$10
  Top 0.2: U1.NTC 31.8,57.05 R12.P1 34.75,57.07 34.78,57.07 R8.1 38.59,57.34 39.5,58.25 39.5,62.25 33.5,68.25 33.5,71.82 JP8.1
N$11
  Top 0.152: 24.93,61.03 R9.1
  Top 0.2: U1.COMPV 24.93,61.03
N$12
  Top 0.152: C11.1
  Top 0.2: R9.2 C11.1
N$13
  Top 0.2: U1.COMPI 24,59.4 22.3,61.1 R10.1
N$14
  Top 0.152: 19.1,61.13 R10.2
  Top 0.2: C4.1 19.1,61.13
N$15
  Top 0.2: 24.98,49.03 C2.1 24.98,53.03 26.3,54.35 26.3,55.4 U1.SW | L2.P1 24.46,48.51 24.98,49.03 | D5.CATHODE 25.03,48.98 24.98,49.03
N$16
  Top 0.2: U1.BST 25.57,54.38 24.05,52.85 23.55,52.85 23.18,52.48 C2.2
N$17
  Top 0.2: U1.CSP 23.25,57.05 22.61,56.41 R11.1 20.36,56.41 19.3,55.35 19.3,52.35 20.81,50.84 L2.P2
N$18
  Top 0.2: U3.8 29.01,28.26 29.8,29.05 TP1.1
N$20
  Top 0.2: U3.4 34.22,24.87 34.4,25.05 34.4,28.83 32.03,31.2 C14.2
N$22
  Top 0.2: R18.1 73.01,48.85 U6.CATH
N$23
  Top 0.2: R19.1 73.01,59.1 U7.CATH
N$24
  Top 0.2: C22.1 85.38,22.68 85.18,22.48 R16.2 83.43,22.48 83.03,22.08 U5.6
N$25
  Top 0.2: Q3.3 77.85,35.7 C23.1 81.35,35.65 Q2.3
N$26
  Top 0.2: Q3.2 75.35,33.05 76.05,32.35 R23.2
N$28
  Top 0.2: Q3.1 73.45,33 72.8,32.35 R20.1
N$29
  Top 0.2: R21.1 79.8,32.35 80.45,33 Q2.1
SCHMITTIN
  Top 0.2: U8.INPUT 83.57,34.87 83.3,34.6 83.3,33.85 83.15,33.7 Q2.2 82.35,33.05 83.05,32.35 R22.1 84.95,31.72 TP7.1
SOUT
  Top 0.2: 27.93,23.32 27.98,23.27
  Top 1: D6.1 23.68,19.25 | 23.68,19.25 23.68,15.98 L3.P1 | 23.68,19.25 27.25,19.25 29.01,21.01 U3.14 | 27.93,23.32 27.5,23.75 27.5,28.5 28.36,29.36 C14.1 | 27.98,23.27 U3.13
  pour Top (no thermals): 29.58,22.05 29.58,24.35 28.48,24.35 28.48,22.05
T_GND  (via drill 0.35)
  Top 0.2: R19.2 69.5,60.3 v69.55,60.35 | v69.55,49.85 69.55,48.9 R18.2
  Bottom 0.2: JP9.1 68.65,60.35 v69.55,60.35 v69.55,49.85
TIMER_TRIGG  (via drill 0.35)
  Top 0.2: U8.OUTPUT 86.48,28.03 84.8,26.35 TP8.1 | v84.05,20.85 84.01,20.81 U5.5
  Bottom 0.2: TP8.1 v84.05,20.85
TIMERPULSE  (via drill 0.35)
  Top 0.2: R28.1 U7.OUT 81.58,56.52 80.8,55.74 80.8,47.1 81.63,46.27 U6.OUT R17.1 v85.87,43.28 | R20.2 v72.8,28.6 TP5.1 | v79.8,28.6 R21.2
  Bottom 0.2: v72.8,28.6 v79.8,28.6 85.87,34.67 v85.87,43.28
TPS-EN
  Top 0.2: R1.1 TP29.1 54.75,45.65 55.91,44.48 U2.14 55.91,42.97 55.72,42.77 U2.1
TPS-FB
  Top 0.2: R3.2 R2.1 52.99,39.04 53.55,39.6 54.8,39.6 55.41,40.22 U2.5
TPS-FB2  (via drill 0.35)
  Top 0.2: TP27.1 53.86,34.41 55.55,36.1 v55.55,37.1 | v55.55,39.35 55.91,39.72 U2.6
  Bottom 0.2: v55.55,39.35 v55.55,37.1
TPS-L1
  Top 0.2: U2.11 60.47,42.52 60.9,42.95 L1.P$1
TPS-L2
  Top 0.2: U2.9 60.38,41.52 60.9,41 L1.P$2
TPS-PG
  Top 0.2: U2.2 54.13,42.27 53.8,42.6 52.8,42.6 51.8,41.6 50.35,41.6 TP26.1
TPS-VAUX
  Top 0.2: C7.1 U2.3
TPS-VSEL
  Top 0.2: TP28.1 52.8,44.35 | 52.8,44.35 55.05,44.35 55.41,43.98 U2.15 | 52.8,44.35 52.21,44.94 R4.2
VIDEO_OUT
  Top 0.2: U4.4 87.21,19.6 88.8,19.6 90.05,20.77 TP10.1 90.05,34.4 91.21,35.56 JP10.3
VUMB
  Top 0.35: U1.VCC 30,56.4
  Top 0.5: D2.ANODE 31.86,54.54 30,56.4
  Top 1: D2.ANODE 39.74,54.54 45.55,60.35 45.55,67.35 49.53,71.33 JP9.4

### Text on the board
tPlace: VID | GND | 12V | 12V | GND | VID | THERM+ | THERM- | ARM- | ARM+ | VUMB | DRO | CHUT | T_GND | BATT THERM | INPUTS | VID | 12V | GND | GND | 12V | VID | BATT+ | 5V | ATV | GND | BATTERY | GND | VIDEO | ARMING SWITCH | +5V STATUS | VID | 12V | GND | GND | 12V | VID | Camera Board Rev 1.0 / 4/23/2020 | VID | GND | 12V | VID | GND | 12V | VID | GND | 12V
Reference: Inputs | LiPo Charger | Pulse Generator | 12V SPS | 5V SPS | Timer